# EAGLE design estacion (EAGLE 6.5.0)
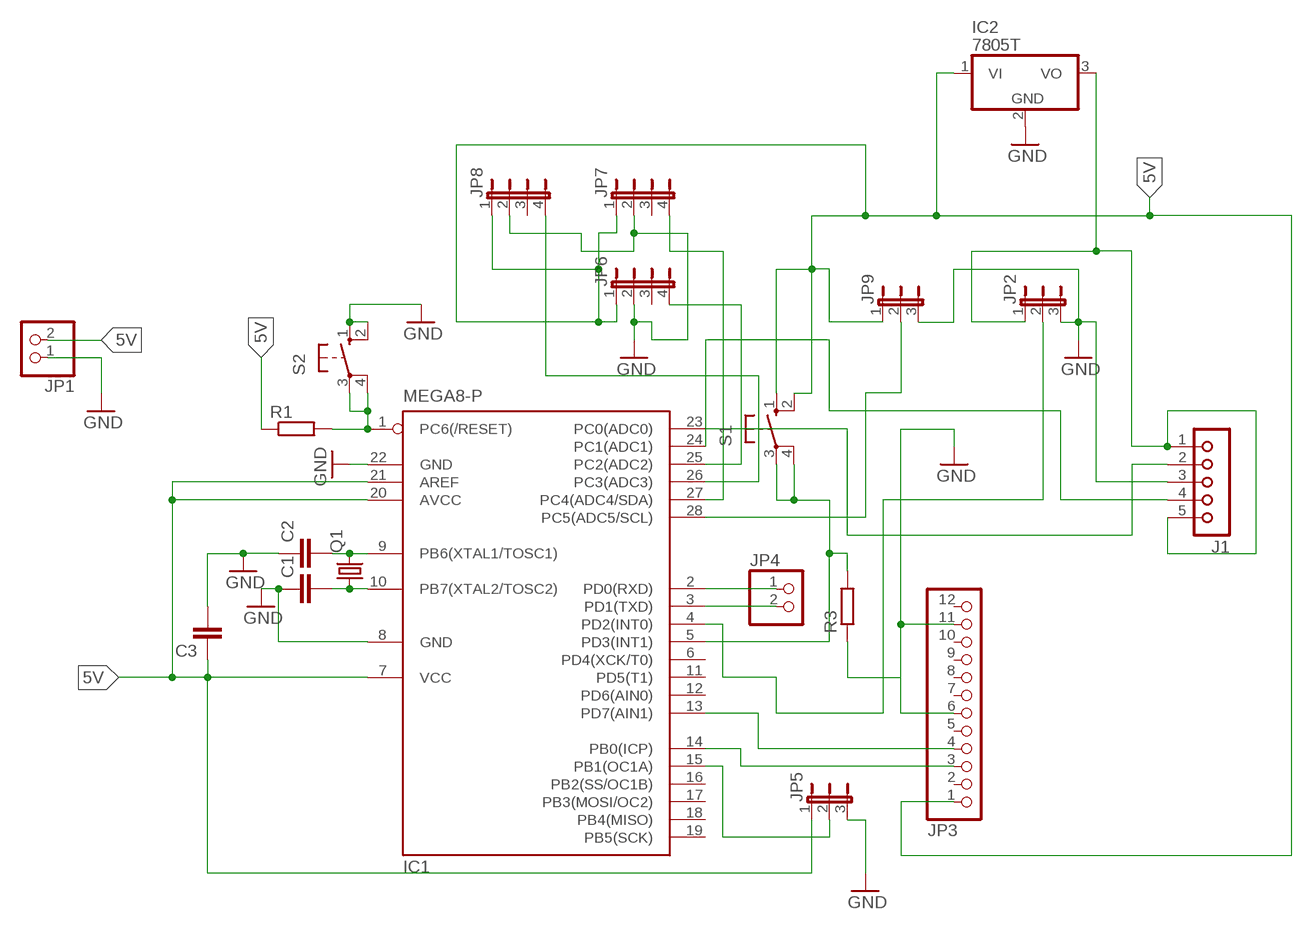
[diagram p0: schematic, sheet 1]

## Parts
C1  C2,5-3  [C2.5-3]
C2  C2,5-3  [C2.5-3]
C3  C2,5-3  [C2.5-3]
IC1  MEGA8-P  [DIL28-3]
IC2  7805T  [TO220H]
J1  JU05  [JU05]
JP1  PINHD-1X2  [1X02]
JP2  JP2W  [JP2W]
JP3  PINHD-1X12  [1X12]
JP4  PINHD-1X2  [1X02]
JP5  JP2W  [JP2W]
JP6  JP4E  [JP4]
JP7  JP4E  [JP4]
JP8  JP4E  [JP4]
JP9  JP2W  [JP2W]
Q1  CRYSTALTC26V  [TC26V]
R1  R-EU_0204/5  [0204/5]
R3  R-EU_0204/5  [0204/5]
S1  10-XX  [B3F-10XX]
S2  10-XX  [B3F-10XX]

## Nets
5V: C3.1 IC1.7(VCC) IC1.20(AVCC) IC1.21(AREF) IC2.1(VI) JP1.2 JP3.1 JP5.1 JP6.1 JP7.1 JP8.1 JP9.1 R1.1 S1.1(S) S1.2(S1)
GND: C1.1 C2.1 C3.2 IC1.8(GND) IC1.22(GND) IC2.2(GND) J1.3 JP1.1 JP2.3 JP3.6 JP3.11 JP5.3 JP6.2 JP7.2 JP8.2 JP9.3 R3.1 S2.1(S) S2.2(S1)
N$2: IC1.14(PB0(ICP)) JP3.3
N$3: IC1.13(PD7(AIN1)) JP3.4
N$4: IC1.5(PD3(INT1)) R3.2 S1.3(P) S1.4(P1)
N$5: IC1.3(PD1(TXD)) JP4.2
N$6: IC1.4(PD2(INT0)) JP2.2
N$7: IC1.2(PD0(RXD)) JP4.1
N$8: IC1.15(PB1(OC1A)) JP5.2
N$9: IC2.3(VO) J1.1 J1.5 JP2.1
N$10: IC1.25(PC2(ADC2)) JP6.4
N$11: IC1.28(PC5(ADC5/SCL)) JP9.2
N$13: IC1.27(PC4(ADC4/SDA)) JP7.4
N$14: C2.2 IC1.9(PB6(XTAL1/TOSC1)) Q1.2
N$15: C1.2 IC1.10(PB7(XTAL2/TOSC2)) Q1.1
N$16: IC1.1(PC6(/RESET)) R1.2 S2.3(P) S2.4(P1)
N$17: IC1.23(PC0(ADC0)) J1.4
N$19: IC1.26(PC3(ADC3)) JP8.4
N$20: IC1.24(PC1(ADC1)) J1.2
Unconnected: IC1.6(PD4(XCK/T0)) IC1.11(PD5(T1)) IC1.12(PD6(AIN0)) IC1.16(PB2(SS/OC1B)) IC1.17(PB3(MOSI/OC2)) IC1.18(PB4(MISO)) IC1.19(PB5(SCK)) JP3.2 JP3.5 JP3.7 JP3.8 JP3.9 JP3.10 JP3.12 JP6.3 JP7.3 JP8.3

## Library data of the parts
C1-C3 = capacitor-wima:C: CAPACITOR naming: grid - package width
IC1 = atmel:MEGA8-P: MICROCONTROLLER 8 Kbytes FLASH, 1 kbytes SRAM, 512 bytes EEPROM, USART, 4-channel 10 bit ADC, 2-channel 8 bit ADC Pin compatible with Atmega48, ATMega88, ATMega168 Source: avr.lbr; OC_FARNELL: unknown; OC_NEWARK: unknown
IC2 = linear:78*: Positive VOLTAGE REGULATOR Source: http://cache.national.com/ds/LM/LM78L05.pdf http://www.fairchildsemi.com/ds/LM/LM7805.pdf
J1 = con-lsta:JU05: PIN HEADER; OC_FARNELL: unknown; OC_NEWARK: unknown
JP1 JP4 = pinhead:PINHD-1X2: PIN HEADER
JP2 JP5 JP9 = jumper:JP2W: JUMPER
JP3 = pinhead:PINHD-1X12: PIN HEADER
JP6-JP8 = jumper:JP4E: JUMPER
Q1 = crystal:CRYSTAL: CRYSTAL; OC_FARNELL: unknown; OC_NEWARK: unknown
R1 R3 = rcl:R-EU_: RESISTOR, European symbol
S1 S2 = switch-omron:10-XX: OMRON SWITCH; MPN: B3F-1000; OC_FARNELL: 176432; OC_NEWARK: 36M3542

## Board
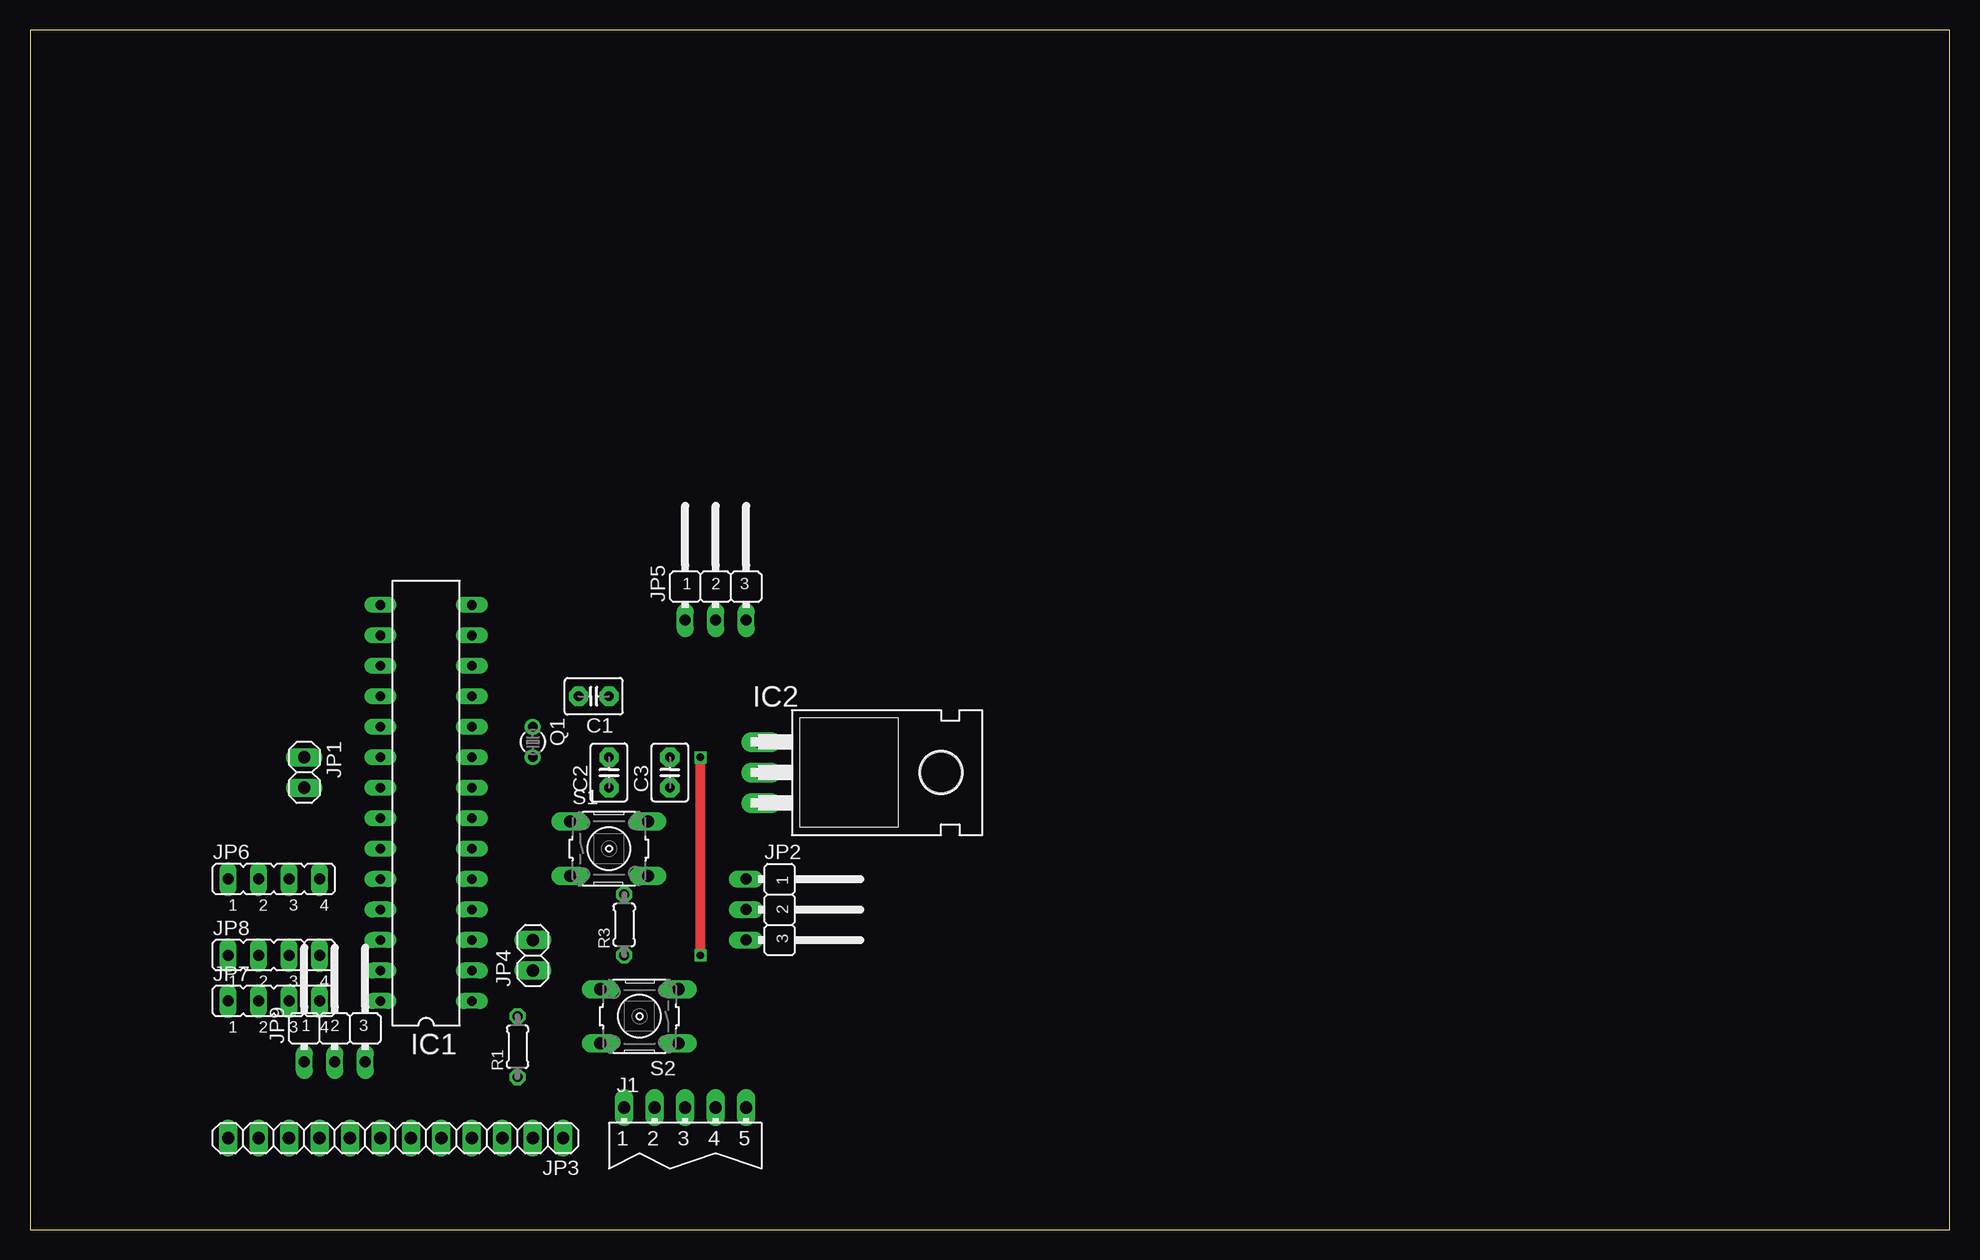
[diagram p1: board, top side]
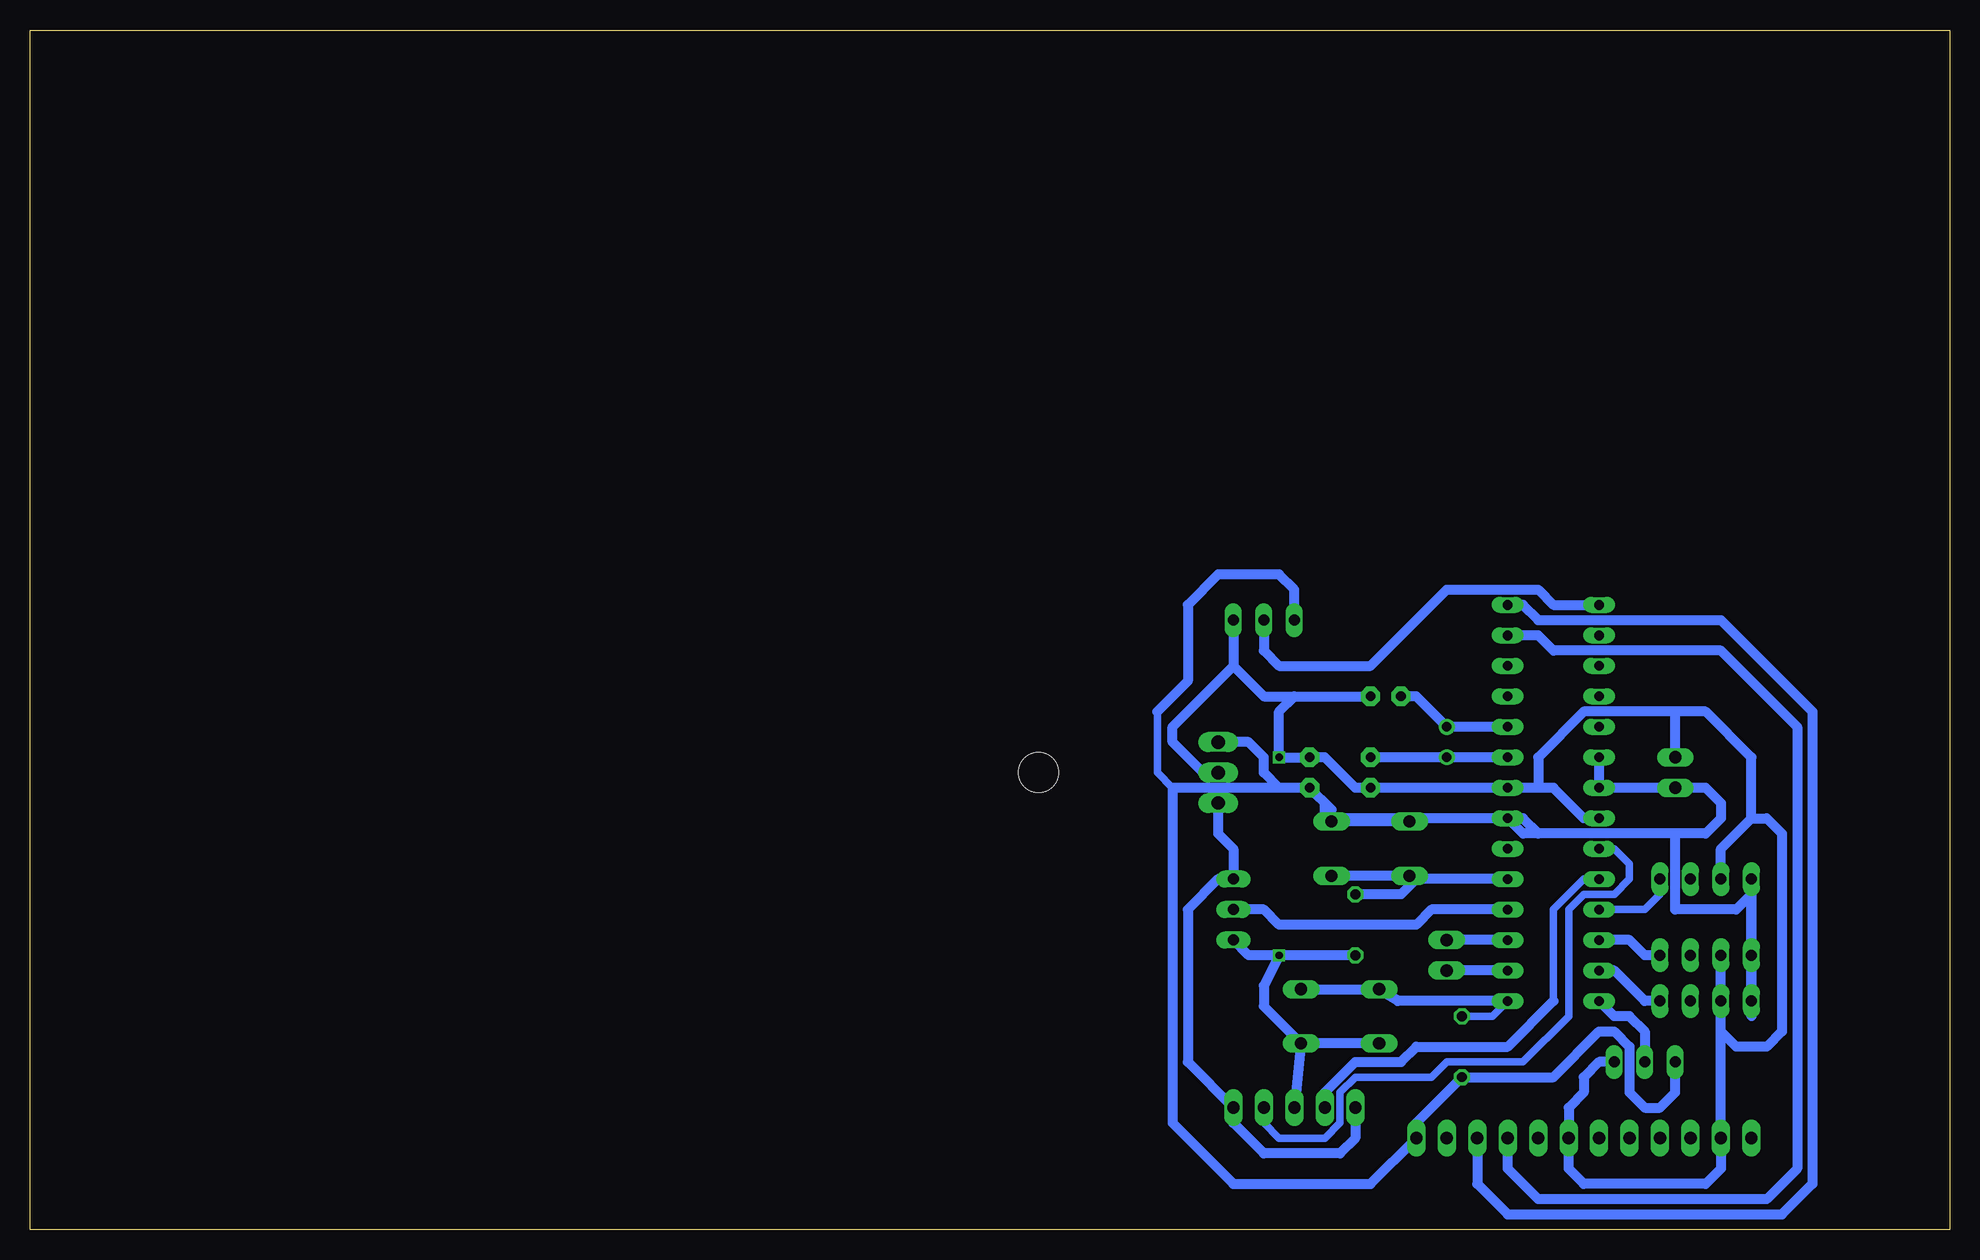
[diagram p2: board, bottom side, seen from below]

Size 160 x 100 mm. Coordinates in mm from the lower left corner, seen from the top.
Outline: 0,0 160,0 160,100 0,100 0,0
Copper layers (1*16): Top 0.035mm / dielectric 1.5mm / Bottom 0.035mm
Design rules "default": minimum track width 10mil, minimum drill 24mil, track to track 8mil, track to pad 8mil, pad to pad 8mil, via to via 8mil, smd to smd 8mil, copper to edge 40mil, drill to drill 8mil, minimum pad ring 10mil, minimum via ring 8mil, stop-mask expansion 4mil, vias tented up to drill 0mil, thermal gap 10mil

### Footprints (pad centres in the part's own frame; a part is rotated, then mirrored left to right if it is on the bottom)
C2.5-3 = drill 0.813 pad 1.6 octagon: 1 -1.27,0; 2 1.27,0
DIL28-3 = drill 0.813 long: 1 -16.51,-3.81; 2 -13.97,-3.81; 3 -11.43,-3.81; 4 -8.89,-3.81; 5 -6.35,-3.81; 6 -3.81,-3.81; 7 -1.27,-3.81; 8 1.27,-3.81; 9 3.81,-3.81; 10 6.35,-3.81; 11 8.89,-3.81; 12 11.43,-3.81; 13 13.97,-3.81; 14 16.51,-3.81; 15 16.51,3.81; 16 13.97,3.81; 17 11.43,3.81; 18 8.89,3.81; 19 6.35,3.81; 20 3.81,3.81; 21 1.27,3.81; 22 -1.27,3.81; 23 -3.81,3.81; 24 -6.35,3.81; 25 -8.89,3.81; 26 -11.43,3.81; 27 -13.97,3.81; 28 -16.51,3.81
TO220H = drill 1.118 long: 1 -2.54,-10.16; 2 0,-10.16; 3 2.54,-10.16 | hole 3.302: 0,4.826
JU05 = drill 1.016 long: 1 -5.08,0; 2 -2.54,0; 3 0,0; 4 2.54,0; 5 5.08,0
1X02 = drill 1.016 long: 1 -1.27,0; 2 1.27,0
JP2W = drill 0.914 long: 1 -2.54,-1.27; 2 0,-1.27; 3 2.54,-1.27
1X12 = drill 1.016 long: 1 -13.97,0; 2 -11.43,0; 3 -8.89,0; 4 -6.35,0; 5 -3.81,0; 6 -1.27,0; 7 1.27,0; 8 3.81,0; 9 6.35,0; 10 8.89,0; 11 11.43,0; 12 13.97,0
JP4 = drill 0.914 long: 1 -3.81,0; 2 -1.27,0; 3 1.27,0; 4 3.81,0
TC26V = drill 0.813: 1 -1.27,0; 2 1.27,0
0204/5 = drill 0.813 octagon: 1 -2.54,0; 2 2.54,0
B3F-10XX = drill 1.016 long: 1 -3.251,2.261; 2 3.251,2.261; 3 -3.251,-2.261; 4 3.251,-2.261

### Placement (x,y rotation side)
C1  46.99,44.45 180 top
C2  48.26,38.1 90 top
C3  53.34,38.1 90 top
IC1  33.02,35.56 90 top
IC2  71.12,38.1 270 top
J1  54.61,10.16 0 top
JP1  22.86,38.1 270 top
JP2  60.96,26.67 270 top
JP3  30.48,7.62 180 top
JP4  41.91,22.86 90 top
JP5  57.15,52.07 0 top
JP6  20.32,29.21 0 top
JP7  20.32,19.05 0 top
JP8  20.32,22.86 0 top
JP9  25.4,15.24 0 top
Q1  41.91,40.64 270 top
R1  40.64,15.24 90 top
R3  49.53,25.4 90 top
S1  48.26,31.75 0 top
S2  50.8,17.78 180 top

### Tracks (layer width: path | path; a pad name or v marks a point on that pad's centre or on a via)
5V
  Bottom 0.61: 64.77,36.83 66.04,38.1 66.04,43.18
  Bottom 0.813: IC1.20 IC1.21 JP1.2 20.32,36.83 19.05,35.56 19.05,34.29 20.32,33.02 22.86,33.02 | 34.29,33.02 35.56,34.29 IC1.7 | IC1.7 44.33,34.29 arc-45 S1.1 S1.2 51.51,35 C3.1 | C3.1 55.88,36.83 57.15,38.1 57.15,39.37 58.42,40.64 IC2.1 | JP5.1 54.61,53.34 55.88,54.61 60.96,54.61 63.5,52.07 63.5,45.72 66.04,43.18 | JP7.1 JP8.1 JP6.1 | 16.51,17.78 JP7.1 | JP9.1 22.86,11.43 24.13,10.16 25.4,10.16 26.67,11.43 26.67,15.24 27.94,16.51 29.21,16.51 33.02,12.7 R1.1 44.45,8.89 JP3.1 48.26,3.81 59.69,3.81 64.77,8.89 64.77,36.83 C3.1 | JP7.1 JP6.1 | JP6.1 16.51,27.94 17.78,26.67 22.86,26.67 22.86,33.02 | 22.86,33.02 34.29,33.02 | 34.29,33.02 35.56,33.02 IC1.7 | IC1.7 52.07,34.29 52.07,35.56
GND  (via drill 0.6)
  Top 0.813: v55.88,22.86 v55.88,39.37
  Bottom 0.813: IC1.22 30.48,34.29 33.02,36.83 34.29,36.83 | 34.29,36.83 IC1.8 C2.1 49.53,36.83 52.07,39.37 C3.2 v55.88,39.37 55.88,43.18 54.61,44.45 | 54.61,44.45 C1.1 | 59.69,46.99 57.15,44.45 54.61,44.45 | JP5.3 59.69,46.99 | S2.2 S2.1 | v55.88,22.86 57.15,20.32 57.15,18.62 S2.1 | IC2.2 62.23,38.1 64.77,40.64 64.77,41.91 59.69,46.99 | S2.1 J1.3 | 16.51,34.29 16.51,39.37 20.32,43.18 22.86,43.18 | 22.86,43.18 30.48,43.18 34.29,39.37 34.29,36.83 | JP1.1 22.86,43.18 | JP6.2 19.05,31.75 16.51,34.29 | 16.51,34.29 15.24,34.29 13.97,33.02 13.97,16.51 15.24,15.24 17.78,15.24 19.05,16.51 | 19.05,16.51 JP7.2 JP8.2 | 19.05,16.51 JP3.11 19.05,5.08 20.32,3.81 30.48,3.81 31.75,5.08 JP3.6 31.75,10.16 30.48,11.43 30.48,12.7 29.21,13.97 JP9.3 | v55.88,22.86 58.42,22.86 JP2.3 | R3.1 v55.88,22.86
N$2
  Bottom 0.813: IC1.14 35.56,52.07 34.29,50.8 19.05,50.8 11.43,43.18 11.43,3.81 13.97,1.27 36.83,1.27 39.37,3.81 JP3.3
N$3
  Bottom 0.813: IC1.13 34.29,49.53 33.02,48.26 19.05,48.26 12.7,41.91 12.7,5.08 15.24,2.54 34.29,2.54 36.83,5.08 JP3.4
N$4
  Bottom 0.813: IC1.5 44.73,29.21 | 44.73,29.21 S1.3 S1.4 | 44.73,29.21 44.73,28.93 45.72,27.94 R3.2
N$5
  Bottom 0.813: IC1.3 JP4.2
N$6
  Bottom 0.813: IC1.4 43.18,26.67 44.45,25.4 55.88,25.4 57.15,26.67 JP2.2
N$7
  Bottom 0.813: IC1.2 JP4.1
N$8
  Bottom 0.813: JP5.2 57.15,48.26 55.88,46.99 48.26,46.99 41.91,53.34 34.29,53.34 33.02,52.07 IC1.15
N$9
  Bottom 0.813: J1.1 49.53,7.62 50.8,6.35 57.15,6.35 59.69,8.89 J1.5 63.5,13.97 63.5,26.67 60.96,29.21 JP2.1 59.69,31.75 60.96,33.02 IC2.3
N$10
  Bottom 0.61: IC1.25 25.4,26.67 24.13,27.94 JP6.4
N$11
  Bottom 0.813: IC1.28 27.94,17.78 26.67,17.78 25.4,16.51 JP9.2
N$13
  Bottom 0.813: JP7.4 25.4,19.05 27.94,21.59 IC1.27
N$14
  Bottom 0.813: IC1.9 Q1.2 C2.2
N$15
  Bottom 0.813: IC1.10 Q1.1 44.45,44.45 C1.2
N$16
  Bottom 0.61: IC1.1 38.1,17.78 R1.2
  Bottom 0.813: IC1.1 46,19.05 S2.4 S2.3
N$17
  Bottom 0.61: J1.4 57.15,8.89 55.88,7.62 52.07,7.62 50.8,8.89 50.8,11.43 49.53,12.7 43.18,12.7 41.91,13.97 35.56,13.97 31.75,17.78 31.75,26.67 30.48,27.94 27.94,27.94 26.67,29.21 26.67,30.48 27.94,31.75 IC1.23
N$19
  Bottom 0.813: JP8.4 25.4,22.86 26.67,24.13 IC1.26
N$20
  Bottom 0.61: IC1.24 30.48,29.21 33.02,26.67 33.02,19.05
  Bottom 0.813: J1.2 52.07,11.43 49.53,13.97 45.72,13.97 44.45,15.24 36.83,15.24 33.02,19.05